# Altium schematic sheet LED_IO.SchDoc
size A4
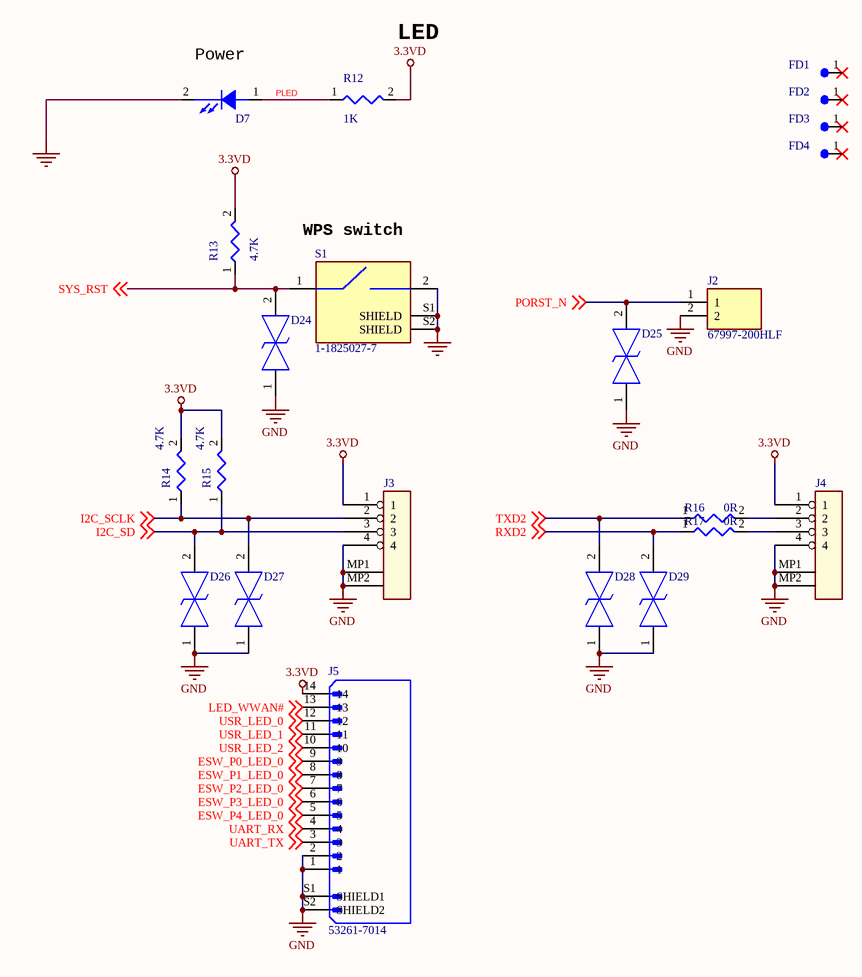
[diagram p0: LED_IO.SchDoc]

## Parts
D7  LED/0603  [LED_0603]  (value not drawn)
D24  ESD9B5VL-2_TR  [ESD9B5VL2TR]  (value not drawn)
D25  ESD9B5VL-2_TR  [ESD9B5VL2TR]  (value not drawn)
D26  ESD9B5VL-2_TR  [ESD9B5VL2TR]  (value not drawn)
D27  ESD9B5VL-2_TR  [ESD9B5VL2TR]  (value not drawn)
D28  ESD9B5VL-2_TR  [ESD9B5VL2TR]  (value not drawn)
D29  ESD9B5VL-2_TR  [ESD9B5VL2TR]  (value not drawn)
FD1  Fiducial  [FD]  (value not drawn)
FD2  Fiducial  [FD]  (value not drawn)
FD3  Fiducial  [FD]  (value not drawn)
FD4  Fiducial  [FD]  (value not drawn)
J2  67997-200HLF  [HDRV2W67P254_2X1_254X483X858P]
J3  0533980471  [0533980471]  (value not drawn)
J4  0533980471  [0533980471]  (value not drawn)
J5  53261-7014  [MOLEX_532617014]
R12  1K  [0402-R]
R13  4.7K  [0402-R]
R14  4.7K  [0603-R]
R15  4.7K  [0603-R]
R16  0R  [0402-R]
R17  0R  [0402-R]
S1  1-1825027-7  [118250277]

## Nets
3.3VD: J3.1 J4.1 J5.14 R12.2 R13.2 R14.2 R15.2
GND: D7.2(CATHODE) D24.1 D25.1 D26.1 D27.1 D28.1 D29.1 J2.2 J3.4 J3.MP1 J3.MP2 J4.4 J4.MP1 J4.MP2 J5.1 J5.2 J5.S1(SHIELD1) J5.S2(SHIELD2) S1.2(NO) S1.S1(SHIELD) S1.S2(SHIELD)
ESW_P0_LED_0: J5.9 ; off-sheet ESW_P0_LED_0
ESW_P1_LED_0: J5.8 ; off-sheet ESW_P1_LED_0
ESW_P2_LED_0: J5.7 ; off-sheet ESW_P2_LED_0
ESW_P3_LED_0: J5.6 ; off-sheet ESW_P3_LED_0
ESW_P4_LED_0: J5.5 ; off-sheet ESW_P4_LED_0
I2C_SCLK: D27.2 J3.2 R14.1 ; off-sheet I2C_SCLK
I2C_SD: D26.2 J3.3 R15.1 ; off-sheet I2C_SD
LED_WWAN#: J5.13 ; off-sheet LED_WWAN#
PLED: D7.1(ANODE) R12.1
PORST_N: D25.2 J2.1 ; off-sheet PORST_N
RXD2: D29.2 R17.1 ; off-sheet RXD2
SYS_RST: D24.2 R13.1 S1.1(COM) ; off-sheet SYS_RST
TXD2: D28.2 R16.1 ; off-sheet TXD2
UART_RX: J5.4 ; off-sheet UART_RX
UART_TX: J5.3 ; off-sheet UART_TX
USR_LED_0: J5.12 ; off-sheet USR_LED_0
USR_LED_1: J5.11 ; off-sheet USR_LED_1
USR_LED_2: J5.10 ; off-sheet USR_LED_2
NetJ4_2: J4.2 R16.2
NetJ4_3: J4.3 R17.2

Not connected (* = marked no-connect by the designer): FD1 1*; FD2 1*; FD3 1*; FD4 1*

## Notes on the sheet
- (near D7) Power
- LED
- WPS switch

## Library data of the parts
D24-D29 = ESD9B5VL-2_TR: TVS Diode (Bi-directional); Manufacturer_Name: Will Semiconductor; Manufacturer_Part_Number: ESD9B5VL-2/TR; Height: 0.55mm
J2 = 67997-200HLF: Connector; Manufacturer_Name: Amphenol Communications Solutions; Datasheet Link: https://cdn.amphenol-cs.com/media/wysiwyg/files/drawing/67996.pdf; Height: 8.58mm; Manufacturer_Part_Number: 67997-200HLF; Mouser Part Number: 649-67997-200HLF; Mouser Price/Stock: https://www.mouser.co.uk/ProductDetail/Amphenol-FCI/67997-200HLF?qs=cpLrBgdhsoGV8OGn4cOuWg%3D%3D; Arrow Part Number: 67997-200HLF; Arrow Price/Stock: https://www.arrow.com/en/products/67997-200hlf/amphenol-fci
J3 = 0533980471: Conn Shrouded Header (3 Sides) HDR 4 POS 1.25mm Solder ST Top Entry SMD PicoBlade™ T/R; Manufacturer: Molex; Manufacturer Part Number: 53398-0471; System: Connector; Supplier 1: RSComponents; RoHS: Yes; Category: Headers and Wire Housings; Stock 1: 1535; Pricing 1: 5=1.26200, 100=1.10100, 375=0.94800, 1500=0.79200, 3000=0.63100 (USD); Supplier Part Number 1: 6563018
J4 = 0533980471: Conn Shrouded Header (3 Sides) HDR 4 POS 1.25mm Solder ST Top Entry SMD PicoBlade™ T/R; Manufacturer: Molex; Manufacturer Part Number: 53398-0471; Supplier 1: RSComponents; RoHS: Yes; Category: Headers and Wire Housings; Stock 1: 1535; Pricing 1: 5=1.26200, 100=1.10100, 375=0.94800, 1500=0.79200, 3000=0.63100 (USD); Supplier Part Number 1: 6563018
J5 = 53261-7014: MP: 532617014; System: connector; Price: None; Value: *; Package: None; Availability: Unavailable
R12-R17 = Res
S1 = 1-1825027-7: Switch; Manufacturer_Name: TE Connectivity; Datasheet Link: https://www.te.com/commerce/DocumentDelivery/DDEController?Action=srchrtrv&DocNm=1308111-1_SWITCHES_CORE_PROGRAM_CATALOG&DocType=CS&DocLang=English; Height: 7.01mm; Manufacturer_Part_Number: 1-1825027-7; Mouser Part Number: 655-1-1825027-7; Mouser Price/Stock: https://www.mouser.co.uk/ProductDetail/TE-Connectivity-PB/1-1825027-7?qs=f77SmbfBTEqvrOH32rsDWQ%3D%3D; Arrow Part Number: 1-1825027-7; Arrow Price/Stock: https://www.arrow.com/en/products/1-1825027-7/te-connectivity